# Altium schematic sheet Altium Demo - ADC Schematic.SchDoc: V1I1
size A3; Engineer: Nevi BATAKLI; SheetNumber: 1; SheetTotal: 1
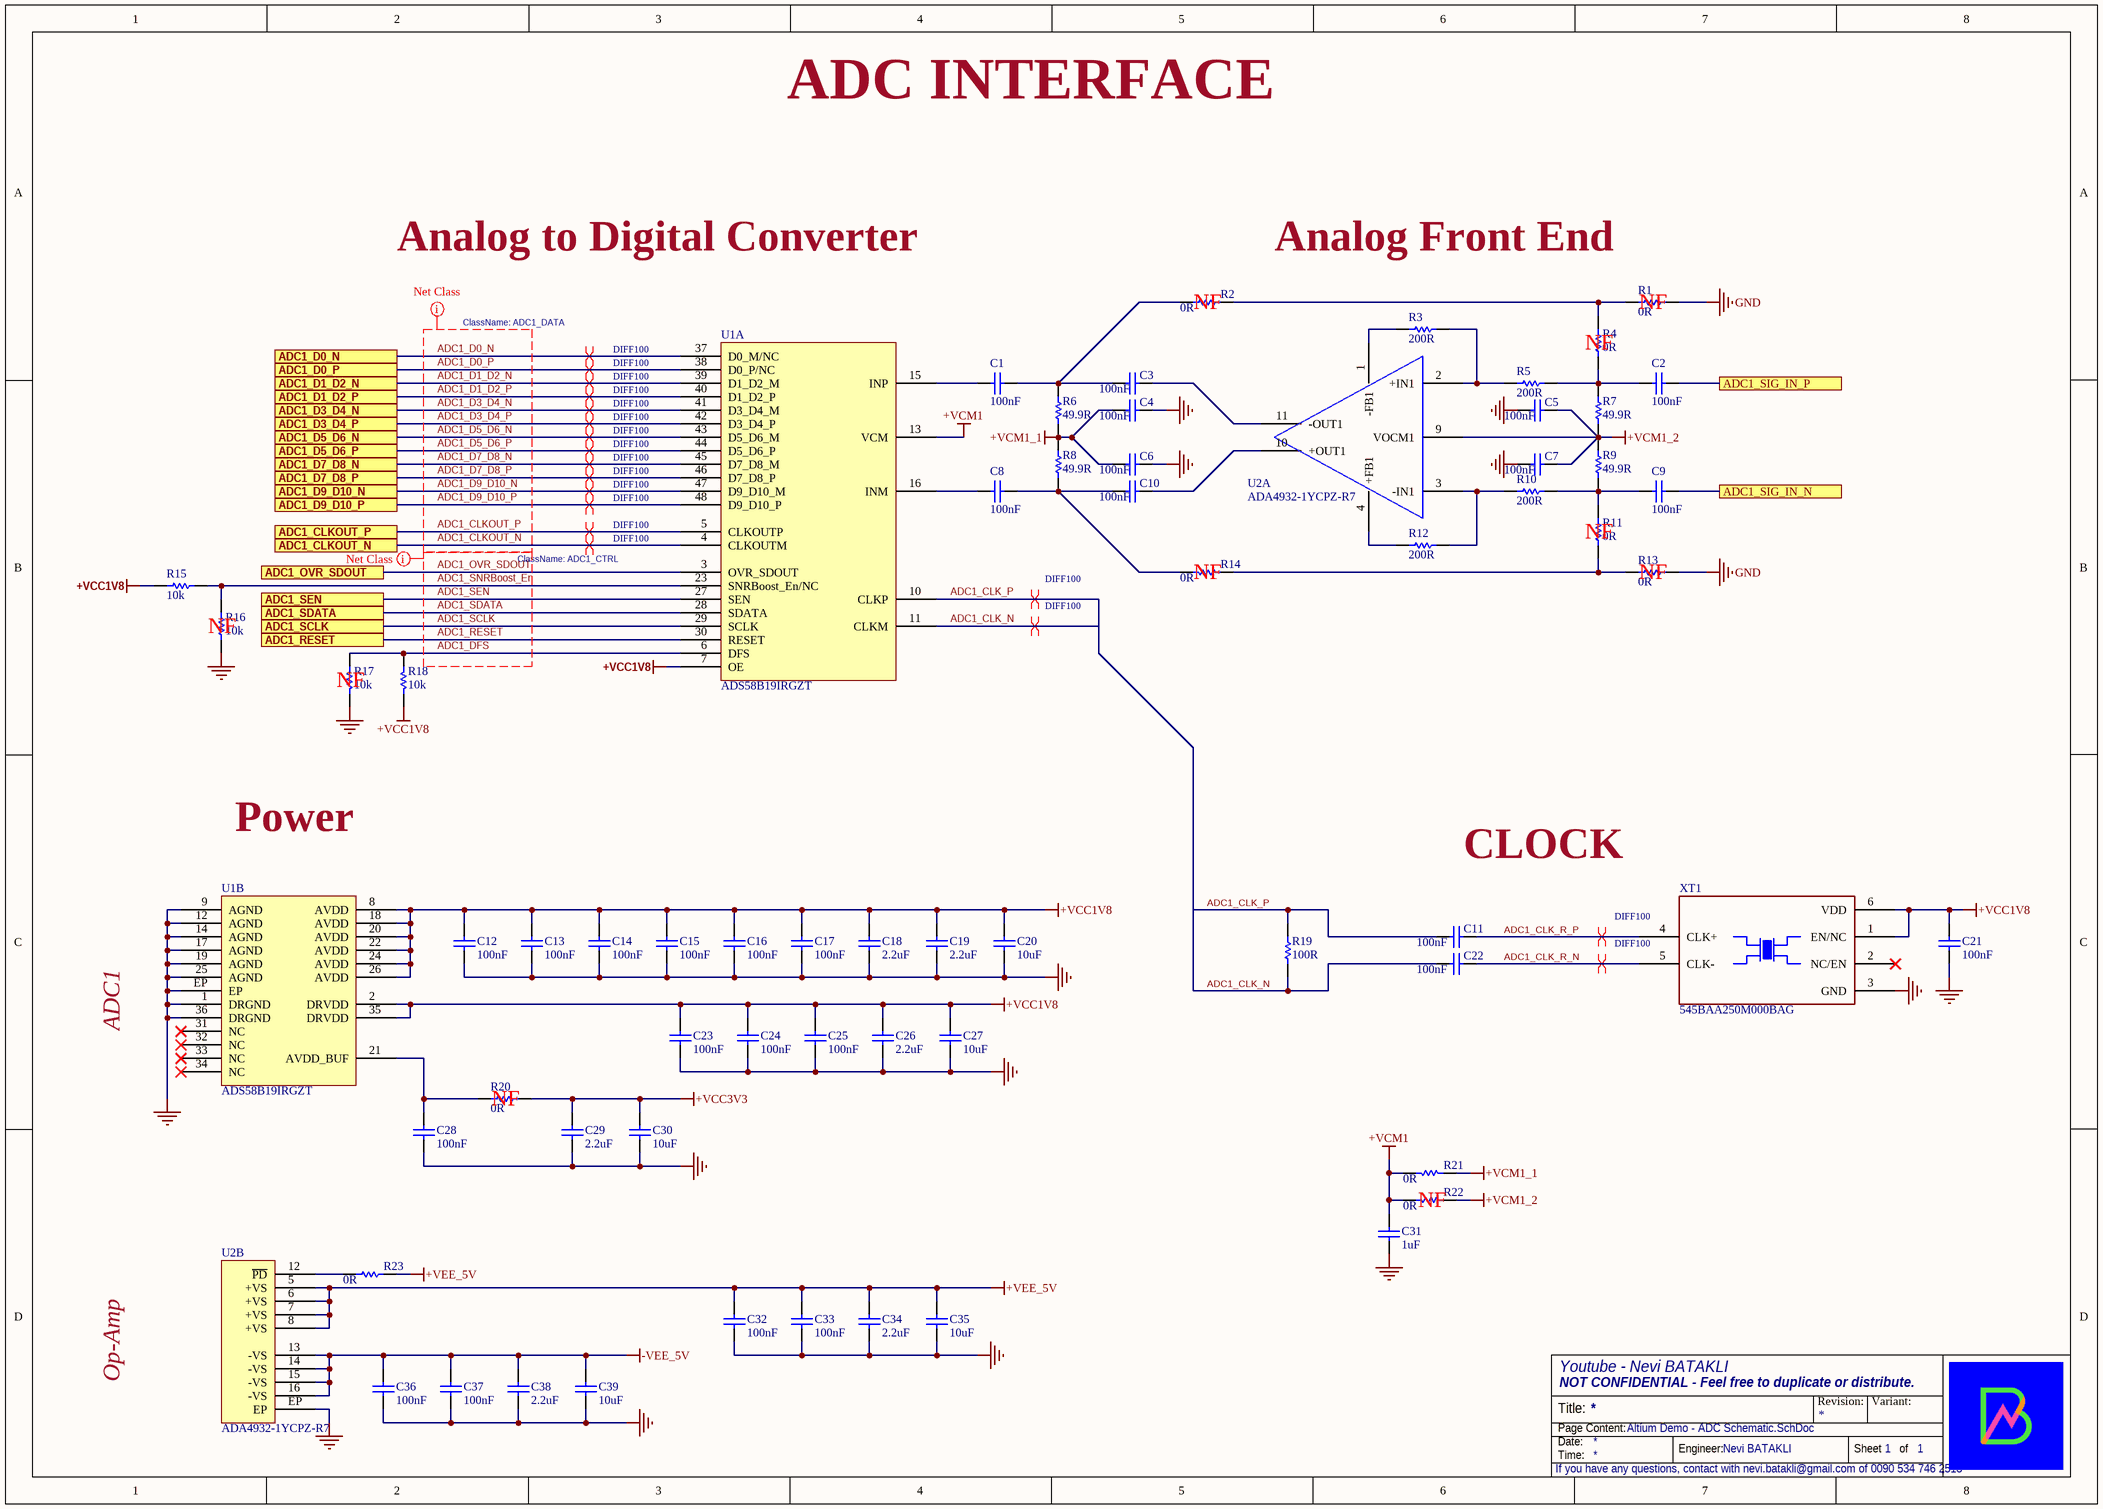
[diagram p0: Altium Demo - ADC Schematic.SchDoc]

## Parts
C1  100nF  [R0201]
C2  100nF  [C0201]
C3  100nF  [C0201]
C4  100nF  [C0402]
C5  100nF  [C0402]
C6  100nF  [C0402]
C7  100nF  [C0402]
C8  100nF  [R0201]
C9  100nF  [C0201]
C10  100nF  [C0201]
C11  100nF  [C0402]
C12  100nF  [C0402]
C13  100nF  [C0402]
C14  100nF  [C0402]
C15  100nF  [C0402]
C16  100nF  [C0402]
C17  100nF  [C0402]
C18  2.2uF  [C0603]
C19  2.2uF  [C0603]
C20  10uF  [C0805]
C21  100nF  [C0402]
C22  100nF  [C0402]
C23  100nF  [C0402]
C24  100nF  [C0402]
C25  100nF  [C0402]
C26  2.2uF  [C0603]
C27  10uF  [C0805]
C28  100nF  [C0402]
C29  2.2uF  [C0603]
C30  10uF  [C0805]
C31  1uF  [C0603]
C32  100nF  [C0402]
C33  100nF  [C0402]
C34  2.2uF  [C0603]
C35  10uF  [C0805]
C36  100nF  [C0402]
C37  100nF  [C0402]
C38  2.2uF  [C0603]
C39  10uF  [C0805]
R1  0R  [R0402]
R2  0R  [R0402]
R3  200R  [R0402]
R4  0R  [R0402]
R5  200R  [R0402]
R6  49.9R  [R0201]
R7  49.9R  [R0402]
R8  49.9R  [R0201]
R9  49.9R  [R0402]
R10  200R  [R0402]
R11  0R  [R0402]
R12  200R  [R0402]
R13  0R  [R0402]
R14  0R  [R0402]
R15  10k  [R0402]
R16  10k  [R0402]
R17  10k  [R0402]
R18  10k  [R0402]
R19  100R  [R0402]
R20  0R  [R0402]
R21  0R  [R0402]
R22  0R  [R0402]
R23  0R  [R0402]
U1  ADS58B19IRGZT  [VFQFN-48 (7x7)]  (parts A,B of 2)
U2  ADA4932-1YCPZ-R7  [VFQFN16 (3x3)]  (parts A,B of 2)
XT1  545BAA250M000BAG  [Si545]

## Ports
ADC1_CLKOUT_N, ADC1_CLKOUT_P, ADC1_D0_N, ADC1_D0_P, ADC1_D1_D2_N, ADC1_D1_D2_P, ADC1_D3_D4_N, ADC1_D3_D4_P, ADC1_D5_D6_N, ADC1_D5_D6_P, ADC1_D7_D8_N, ADC1_D7_D8_P, ADC1_D9_D10_N, ADC1_D9_D10_P, ADC1_OVR_SDOUT, ADC1_RESET, ADC1_SCLK, ADC1_SDATA, ADC1_SEN, ADC1_SIG_IN_N, ADC1_SIG_IN_P

## Nets
+VCC1V8: C12.1 C13.1 C14.1 C15.1 C16.1 C17.1 C18.1 C19.1 C20.1 C21.1 C23.1 C24.1 C25.1 C26.1 C27.1 R15.2 R18.2 U1.2(DRVDD) U1.7(OE) U1.8(AVDD) U1.18(AVDD) U1.20(AVDD) U1.22(AVDD) U1.24(AVDD) U1.26(AVDD) U1.35(DRVDD) XT1.1(EN/NC) XT1.6(VDD)
+VCC3V3: C29.1 C30.1 R20.1
+VCM1: C31.1 R21.2 R22.2 U1.13(VCM)
+VCM1_1: C4.2 C6.2 R6.1 R8.2 R21.1
+VCM1_2: C5.1 C7.1 R7.1 R9.2 R22.1 U2.9(VOCM1)
+VEE_5V: C32.1 C33.1 C34.1 C35.1 R23.1 U2.5(+VS) U2.6(+VS) U2.7(+VS) U2.8(+VS)
-VEE_5V: C36.1 C37.1 C38.1 C39.1 U2.13(-VS) U2.14(-VS) U2.15(-VS) U2.16(-VS)
GND: C4.1 C5.2 C6.1 C7.2 C12.2 C13.2 C14.2 C15.2 C16.2 C17.2 C18.2 C19.2 C20.2 C21.2 C23.2 C24.2 C25.2 C26.2 C27.2 C28.2 C29.2 C30.2 C31.2 C32.2 C33.2 C34.2 C35.2 C36.2 C37.2 C38.2 C39.2 R1.1 R13.2 R16.2 R17.2 U1.1(DRGND) U1.9(AGND) U1.12(AGND) U1.14(AGND) U1.17(AGND) U1.19(AGND) U1.25(AGND) U1.36(DRGND) U1.EP U2.EP XT1.3(GND)
ADC1_CLK_N: C22.2 R19.1 U1.11(CLKM)
ADC1_CLK_P: C11.2 R19.2 U1.10(CLKP)
ADC1_CLK_R_N: C22.1 XT1.5(CLK-)
ADC1_CLK_R_P: C11.1 XT1.4(CLK+)
ADC1_CLKOUT_N: U1.4(CLKOUTM) ; port ADC1_CLKOUT_N
ADC1_CLKOUT_P: U1.5(CLKOUTP) ; port ADC1_CLKOUT_P
ADC1_D0_N: U1.37(D0_M/NC) ; port ADC1_D0_N
ADC1_D0_P: U1.38(D0_P/NC) ; port ADC1_D0_P
ADC1_D1_D2_N: U1.39(D1_D2_M) ; port ADC1_D1_D2_N
ADC1_D1_D2_P: U1.40(D1_D2_P) ; port ADC1_D1_D2_P
ADC1_D3_D4_N: U1.41(D3_D4_M) ; port ADC1_D3_D4_N
ADC1_D3_D4_P: U1.42(D3_D4_P) ; port ADC1_D3_D4_P
ADC1_D5_D6_N: U1.43(D5_D6_M) ; port ADC1_D5_D6_N
ADC1_D5_D6_P: U1.44(D5_D6_P) ; port ADC1_D5_D6_P
ADC1_D7_D8_N: U1.45(D7_D8_M) ; port ADC1_D7_D8_N
ADC1_D7_D8_P: U1.46(D7_D8_P) ; port ADC1_D7_D8_P
ADC1_D9_D10_N: U1.47(D9_D10_M) ; port ADC1_D9_D10_N
ADC1_D9_D10_P: U1.48(D9_D10_P) ; port ADC1_D9_D10_P
ADC1_DFS: R17.1 R18.1 U1.6(DFS)
ADC1_OVR_SDOUT: U1.3(OVR_SDOUT) ; port ADC1_OVR_SDOUT
ADC1_RESET: U1.30(RESET) ; port ADC1_RESET
ADC1_SCLK: U1.29(SCLK) ; port ADC1_SCLK
ADC1_SDATA: U1.28(SDATA) ; port ADC1_SDATA
ADC1_SEN: U1.27(SEN) ; port ADC1_SEN
ADC1_SIG_IN_N: C9.2 ; port ADC1_SIG_IN_N
ADC1_SIG_IN_P: C2.2 ; port ADC1_SIG_IN_P
ADC1_SNRBoost_En: R15.1 R16.1 U1.23(SNRBoost_En/NC)
NetC1_1: C1.1 U1.15(INP)
NetC1_2: C1.2 C3.1 R2.1 R6.2
NetC2_1: C2.1 R4.2 R5.2 R7.2
NetC3_2: C3.2 U2.11(-OUT1)
NetC8_1: C8.1 U1.16(INM)
NetC8_2: C8.2 C10.1 R8.1 R14.1
NetC9_1: C9.1 R9.1 R10.2 R11.1
NetC10_2: C10.2 U2.10(+OUT1)
NetC28_1: C28.1 R20.2 U1.21(AVDD_BUF)
NetR1_2: R1.2 R2.2 R4.1
NetR3_1: R3.1 U2.1(-FB1)
NetR3_2: R3.2 R5.1 U2.2(+IN1)
NetR10_1: R10.1 R12.2 U2.3(-IN1)
NetR11_2: R11.2 R13.1 R14.2
NetR12_1: R12.1 U2.4(+FB1)
NetR23_2: R23.2 U2.12(~{PD})

Not connected (* = marked no-connect by the designer): U1 31(NC)* 32(NC)* 33(NC)* 34(NC)*; XT1 2(NC/EN)*

## Layout directives
net class ADC1_DATA: ADC1_CLKOUT_N, ADC1_CLKOUT_P, ADC1_D0_N, ADC1_D0_P, ADC1_D1_D2_N, ADC1_D1_D2_P, ADC1_D3_D4_N, ADC1_D3_D4_P, ADC1_D5_D6_N, ADC1_D5_D6_P, ADC1_D7_D8_N, ADC1_D7_D8_P, ADC1_D9_D10_N, ADC1_D9_D10_P
differential pair; net class DIFF100: ADC1_CLK_N, ADC1_CLK_P, ADC1_CLK_R_N, ADC1_CLK_R_P, ADC1_CLKOUT_N, ADC1_CLKOUT_P, ADC1_D0_N, ADC1_D0_P, ADC1_D1_D2_N, ADC1_D1_D2_P, ADC1_D3_D4_N, ADC1_D3_D4_P, ADC1_D5_D6_N, ADC1_D5_D6_P, ADC1_D7_D8_N, ADC1_D7_D8_P, ADC1_D9_D10_N, ADC1_D9_D10_P
net class ADC1_CTRL: ADC1_DFS, ADC1_OVR_SDOUT, ADC1_RESET, ADC1_SCLK, ADC1_SDATA, ADC1_SEN, ADC1_SNRBoost_En

## Notes on the sheet
- ADC INTERFACE
- Analog to Digital Converter
- (near R2) NF
- Analog Front End
- (near R1) NF
- (near R4) NF
- (near R14) NF
- (near R11) NF
- (near R13) NF
- (near R16) NF
- (near R17) NF
- Power
- CLOCK
- ADC1
- (near R20) NF
- (near R22) NF
- Op-Amp
- Youtube - Nevi BATAKLI
- NOT CONFIDENTIAL - Feel free to duplicate or distribute.
- Title:
- Page Content:
- Date:
- Time:
- Engineer:
- Revision:
- Sheet
- Variant:
- of
- If you have any questions, contact with nevi.batakli@gmail.com of 0090 534 746 2518

## Library data of the parts
C1-C3 C8-C10 = GRM033C81E104ME14D: CAP CER 0.1UF 25V X6S 0201; Manufacturer 1: Murata; Tolerance: 20%; Supplier 1: Digi-Key; RoHS: Yes; Stock 1: 171376; Pricing 1: 1=0.10000, 10=0.05300, 100=0.02370, 500=0.01690, 1000=0.01328, 2500=0.01208, 5000=0.01111 (USD); Mount: Surface Mount; Case/Package: 0201; Case Code (Metric): 0603; Case Code (Imperial): 0201; Min Operating Temperature: -55°C; Max Operating Temperature: 105°C; Capacitance: 100nF; Packaging: Tape and Reel; Voltage Rating: 25V; Length: 0.024inch; Width: 0.012inch; Thickness: 0.013inch; Supplier Part Number 1: 490-10404-1-ND; Manufacturer Part Number 1: GRM033C81E104ME14D; Weight: 1.2E-05oz; Dielectric: X6S; Termination: SMD/SMT; Voltage Rating (DC): 25V; Package Quantity: 15000; Height: 0.3mm; ComponentLink1URL: http://www.mouser.com/ds/2/281/c02e-2905.pdf?src-supplier=Mouser; ComponentLink1Description: http://www.mouser.com/ds/2/281/c02e-2905.pdf?src-supplier=Mouser; ComponentLink2URL: http://search.murata.co.jp/Ceramy/image/img/A01X/G101/ENG/GRM033C81E104ME14-01.pdf?src-supplier=Digi-Key; ComponentLink2Description: http://search.murata.co.jp/Ceramy/image/img/A01X/G101/ENG/GRM033C81E104ME14-01.pdf?src-supplier=Digi-Key; ComponentLink3URL: http://search.murata.co.jp/Ceramy/image/img/A01X/partnumbering_e_01.pdf?src-supplier=Digi-Key; ComponentLink3Description: http://search.murata.co.jp/Ceramy/image/img/A01X/partnumbering_e_01.pdf?src-supplier=Digi-Key
C4-C7 C11-C17 C21-C25 C28 C32 C33 C36 C37 = CL05B104KO5NNNC: Cap Ceramic 0.1uF 16V X7R 10% SMD 0402 125C Paper T/R; Manufacturer: Samsung; .Creator: NB; Supplier 1: Digi-Key; Manufacturer Part Number: CL05B104KO5NNNC; RoHS: Yes; Stock 1: 74884048; Pricing 1: 1 = 0.10000, 10 = 0.02400, 100 = 0.01070, 500 = 0.00762, 1000 = 0.00598, 2500 = 0.00544, 5000 = 0.00500 (USD); Mount: Surface Mount; Case/Package: 0402; Case Code (Metric): 1005; Case Code (Imperial): 0402; Min Operating Temperature: -55°C; Max Operating Temperature: 125°C; Capacitance: 100nF; Packaging: Tape and Reel; Voltage Rating: 16V; Tolerance: 10%; Length: 1mm; Width: 0.02inch; Thickness: 0.022inch; Lead Free: Lead Free; Supplier Part Number 1: 1276-1001-1-ND; Material: Ceramic; Contact Plating: Tin; Package Quantity: 1; Dielectric: X7R; Voltage: 16V; Voltage Rating (DC): 16V; Height: 0.5mm; Depth: 0.5mm; Radiation Hardening: No; ComponentLink1URL: http://www1.futureelectronics.com/doc/SAMSUNG%20PASSIVE/CL05B104KQ5NNNC.pdf; ComponentLink1Description: http://www1.futureelectronics.com/doc/SAMSUNG%20PASSIVE/CL05B104KQ5NNNC.pdf; ComponentLink2URL: https://www.verical.com/server-webapp/html/getDatasheet?partID=359683; ComponentLink2Description: https://www.verical.com/server-webapp/html/getDatasheet?partID=359683; ComponentLink3URL: https://www.distrelec.biz/Web/Downloads/_e/ng/MLCC_CatalogDownload2013_ENG.pdf?mime=application%2Fpdf; ComponentLink3Description: https://www.distrelec.biz/Web/Downloads/_e/ng/MLCC_CatalogDownload2013_ENG.pdf?mime=application%2Fpdf; ComponentLink4URL: https://produktinfo.conrad.com/datenblaetter/450000-474999/458718-da-01-en-VS_KONDENSATOR_0402.pdf; ComponentLink4Description: https://produktinfo.conrad.com/datenblaetter/450000-474999/458718-da-01-en-VS_KONDENSATOR_0402.pdf
C18 C19 C26 C29 C34 C38 = CL10A225KO8NNNC: Cap Ceramic 2.2uF 16V X5R 10% SMD 0603 85C Paper T/R; Manufacturer: Samsung; .Creator: NB; Supplier 1: Digi-Key; Manufacturer Part Number: CL10A225KO8NNNC; RoHS: Yes; Stock 1: 19734; Pricing 1: 1 = 0.14000, 10 = 0.09600, 100 = 0.04530, 500 = 0.03176, 1000 = 0.02629 (USD); Mount: Surface Mount; Case/Package: 0603; Case Code (Metric): 1608; Case Code (Imperial): 0603; Material: Ceramic; Contact Plating: Tin; Min Operating Temperature: -55°C; Max Operating Temperature: 85°C; Capacitance: 2.2uF; Tolerance: 10%; Packaging: Tape and Reel; Package Quantity: 4000; Voltage Rating: 16V; Dielectric: X5R; Voltage: 16V; Voltage Rating (DC): 16V; Length: 1.6mm; Height: 0.8mm; Width: 0.031inch; Thickness: 0.035inch; Depth: 0.8mm; Radiation Hardening: No; Lead Free: Lead Free; ComponentLink1URL: https://www.verical.com/server-webapp/html/getDatasheet?partID=355165&src-supplier=Verical; ComponentLink1Description: https://www.verical.com/server-webapp/html/getDatasheet?partID=355165&src-supplier=Verical; ComponentLink2URL: http://www.samsungsem.com/kr/support/product-search/mlcc/__icsFiles/afieldfile/2016/08/18/S_CL10A225KO8NNNC.pdf?src-supplier=Digi-Key; ComponentLink2Description: http://www.samsungsem.com/kr/support/product-search/mlcc/__icsFiles/afieldfile/2016/08/18/S_CL10A225KO8NNNC.pdf?src-supplier=Digi-Key; ComponentLink3URL: http://www1.futureelectronics.com/doc/SAMSUNG%20PASSIVE/CL05B104KQ5NNNC.pdf?src-supplier=Future+Electronics; ComponentLink3Description: http://www1.futureelectronics.com/doc/SAMSUNG%20PASSIVE/CL05B104KQ5NNNC.pdf?src-supplier=Future+Electronics; ComponentLink4URL: https://produktinfo.conrad.com/datenblaetter/450000-474999/457919-da-01-en-VS_KONDENSATOR_0603.pdf?src-supplier=Conrad; ComponentLink4Description: https://produktinfo.conrad.com/datenblaetter/450000-474999/457919-da-01-en-VS_KONDENSATOR_0603.pdf?src-supplier=Conrad; Supplier Part Number 1: 1276-1040-1-ND
C20 C27 C30 C35 C39 = CL21A106KOQNNNG: CAP CER 10UF 16V X5R 0805; Manufacturer: Samsung; Material: Ceramic; Tolerance: 10%; .Creator: NB; Supplier 1: Digi-Key; Manufacturer Part Number: CL21A106KOQNNNG; RoHS: Yes; Stock 1: 74251; Pricing 1: 1 = 0.17000, 10 = 0.12300, 100 = 0.05800, 500 = 0.04064, 1000 = 0.03365 (USD); Mount: Surface Mount; Case/Package: 0805; Case Code (Metric): 2012; Case Code (Imperial): 0805; Min Operating Temperature: -55°C; Max Operating Temperature: 85°C; Packaging: Tape and Reel; Package Quantity: 3000; Capacitance: 10uF; Voltage Rating: 16V; Dielectric: X5R; Voltage: 16V; Length: 2mm; Height: 1.25mm; Width: 0.049inch; Thickness: 0.053inch; Depth: 1.25mm; ComponentLink1URL: http://www.samsungsem.com/kr/support/product-search/mlcc/CL21A106KOQNNNG.jsp?src-supplier=Digi-Key; ComponentLink1Description: http://www.samsungsem.com/kr/support/product-search/mlcc/CL21A106KOQNNNG.jsp?src-supplier=Digi-Key; ComponentLink2URL: https://produktinfo.conrad.com/datenblaetter/450000-474999/454932-da-01-en-VS_KONDENSATOR_0805.pdf?src-supplier=Conrad; ComponentLink2Description: https://produktinfo.conrad.com/datenblaetter/450000-474999/454932-da-01-en-VS_KONDENSATOR_0805.pdf?src-supplier=Conrad; Supplier Part Number 1: 1276-6455-1-ND
C31 = CL05B104KO5VPNC: Cap Ceramic 0.1uF 16V X7R 10% SMD 0402 125C Automotive Cardboard T/R; Manufacturer: Samsung; Capacitance: 100nF; .Creator: NB; Supplier 1: Digi-Key; Manufacturer Part Number: CL05B104KO5VPNC; RoHS: Yes; Stock 1: 1650666; Pricing 1: 1 = 0.10000, 10 = 0.03100, 100 = 0.01360, 500 = 0.00974, 1000 = 0.00766, 2500 = 0.00696, 5000 = 0.00640 (USD); Mount: Surface Mount; Case/Package: 0402; Case Code (Metric): 1005; Case Code (Imperial): 0402; Min Operating Temperature: -55°C; Max Operating Temperature: 125°C; Packaging: Cut Tape; Voltage Rating: 16V; Tolerance: 10%; Features: Soft Termination; Length: 0.039inch; Width: 0.02inch; Thickness: 0.022inch; Ratings: AEC-Q200; Lead Free: Lead Free; Supplier 2: Digi-Key; Stock 2: 1650666; Pricing 2: 1 = 0.10000, 10 = 0.03100, 100 = 0.01360, 500 = 0.00974, 1000 = 0.00766, 2500 = 0.00696, 5000 = 0.00640 (USD); Supplier Part Number 1: 1276-6844-1-ND; Supplier Part Number 2: 1276-6844-6-ND
R1 R2 R4 R11 R13 R14 R20-R23 = RC0402JR-070RL: RES SMD 0.0OHM JUMPER 1/16W 0402; Manufacturer: Yageo; .Creator: NB; Resistance: 0mR; Tolerance: 5%; Voltage Rating: 50V; Max Power Dissipation: 63mW; Temperature Coefficient: 200ppm/°C; Power Rating: 62.5mW; Supplier 1: Digi-Key; Manufacturer Part Number: RC0402JR-070RL; Stock 1: 27644767; Pricing 1: 1=0.1, 10=0.014, 25=0.01, 50=0.0078, 100=0.0057, 250=0.00436, 500=0.00348, 1000=0.00257, 5000=0.00184 (USD); Case/Package: 0402; Contact Plating: Matte,Tin; Case Code (Metric): 1005; Case Code (Imperial): 0402; Min Operating Temperature: -55°C; Max Operating Temperature: 155°C; Packaging: Tape and Reel; Composition: Thick Film; Package Quantity: 1; Number of Terminations: 2; Termination: SMD/SMT; Military Standard: Not; Features: Moisture Resistant; Length: 1mm; Height: 0.016inch; Width: 0.02inch; Depth: 0.5mm; Radiation Hardening: No; REACH SVHC: Unknown; Lead Free: Lead Free; ComponentLink1URL: http://www.yageo.com/documents/recent/PYu-RC_Group_51_RoHS_L_9.pdf; ComponentLink1Description: http://www.yageo.com/documents/recent/PYu-RC_Group_51_RoHS_L_9.pdf; ComponentLink2URL: http://www.yageo.com/documents/recent/PYu-RC0402_51_RoHS_L_6.pdf; ComponentLink2Description: http://www.yageo.com/documents/recent/PYu-RC0402_51_RoHS_L_6.pdf; ComponentLink3URL: http://www.farnell.com/datasheets/1018594.pdf; ComponentLink3Description: http://www.farnell.com/datasheets/1018594.pdf; ComponentLink4URL: https://www.verical.com/server-webapp/html/getDatasheet?partID=326379; ComponentLink4Description: https://www.verical.com/server-webapp/html/getDatasheet?partID=326379; ComponentLink5URL: http://www.farnell.com/datasheets/2167052.pdf; ComponentLink5Description: http://www.farnell.com/datasheets/2167052.pdf; Supplier Part Number 1: 311-0.0JRCT-ND
R3 R5 R10 R12 = RC0402FR-07200RL: RES SMD 200 OHM 1% 1/16W 0402; Manufacturer 1: Yageo; Power Rating: 63mW; Voltage Rating: 50V; Temperature Coefficient: 100ppm/°C; Supplier 1: Digi-Key; Manufacturer Part Number 1: RC0402FR-07200RL; Stock 1: 6769600; Pricing 1: 1=0.10000, 10=0.01600, 100=0.00670, 1000=0.00301, 2500=0.00261, 5000=0.00215 (USD); RoHS: Yes; Case/Package: 0402; Case Code (Metric): 1005; Case Code (Imperial): 0402; Min Operating Temperature: -55°C; Max Operating Temperature: 155°C; Resistance: 200R; Tolerance: 1%; Packaging: Tape and Reel; Package Quantity: 1; Composition: Thick Film; Number of Terminations: 2; Termination: SMD/SMT; Military Standard: Not; Max Power Dissipation: 63mW; Voltage Rating (DC): 50V; Features: Moisture Resistant; Length: 1mm; Height: 0.016inch; Width: 0.02inch; Depth: 0.5mm; REACH SVHC: No SVHC; Lead Free: Lead Free; ComponentLink1URL: https://datasheet.ciiva.com/2553/pyu-r-int-thick-7-2553232.pdf?src-supplier=Digi-Key; ComponentLink1Description: https://datasheet.ciiva.com/2553/pyu-r-int-thick-7-2553232.pdf?src-supplier=Digi-Key; ComponentLink2URL: https://datasheet.ciiva.com/7983/1018594-7983509.pdf?src-supplier=Element14; ComponentLink2Description: https://datasheet.ciiva.com/7983/1018594-7983509.pdf?src-supplier=Element14; ComponentLink3URL: https://datasheet.ciiva.com/16804/pyu-rc0402-51-rohs-l-6-r-16804406.pdf?src-supplier=Future+Electronics; ComponentLink3Description: https://datasheet.ciiva.com/16804/pyu-rc0402-51-rohs-l-6-r-16804406.pdf?src-supplier=Future+Electronics; ComponentLink4URL: https://datasheet.ciiva.com/15189/getdatasheetpartid-331152-15189383.pdf?src-supplier=Verical; ComponentLink4Description: https://datasheet.ciiva.com/15189/getdatasheetpartid-331152-15189383.pdf?src-supplier=Verical; ComponentLink5URL: https://datasheet.ciiva.com/7849/1018594-7849898.pdf?src-supplier=Element14; ComponentLink5Description: https://datasheet.ciiva.com/7849/1018594-7849898.pdf?src-supplier=Element14; ComponentLink6URL: https://datasheet.ciiva.com/5562/pyu-rc0402-51-rohs-l-6-r-8721-5562539.pdf?src-supplier=Mouser; ComponentLink6Description: https://datasheet.ciiva.com/5562/pyu-rc0402-51-rohs-l-6-r-8721-5562539.pdf?src-supplier=Mouser; ComponentLink7URL: https://datasheet.ciiva.com/7849/1018594-7849899.pdf?src-supplier=Element14; ComponentLink7Description: https://datasheet.ciiva.com/7849/1018594-7849899.pdf?src-supplier=Element14; ComponentLink8URL: https://datasheet.ciiva.com/2553/pyu-r-int-thick-7-2553230.pdf?src-supplier=Digi-Key; ComponentLink8Description: https://datasheet.ciiva.com/2553/pyu-r-int-thick-7-2553230.pdf?src-supplier=Digi-Key; ComponentLink9URL: https://datasheet.ciiva.com/2553/pyu-r-int-thick-7-2553231.pdf?src-supplier=Digi-Key; ComponentLink9Description: https://datasheet.ciiva.com/2553/pyu-r-int-thick-7-2553231.pdf?src-supplier=Digi-Key; Supplier Part Number 1: 311-200LRCT-ND
R6 R8 = Res_DNP: .Creator: NB; .SCHChecked: NB
R7 R9 = RC0402FR-0749R9L: RES SMD 49.9 OHM 1% 1/16W 0402; Manufacturer 1: Yageo; Voltage Rating (DC): 50V; Power Rating: 62.5mW; Temperature Coefficient: 100ppm/°C; Max Power Dissipation: 63mW; Supplier 1: Digi-Key; Manufacturer Part Number 1: RC0402FR-0749R9L; Stock 1: 20668289; Pricing 1: 1=0.10000, 10=0.01600, 100=0.00670, 1000=0.00301, 2500=0.00261, 5000=0.00215 (USD); RoHS: Yes; Case/Package: 0402; Number of Pins: 2; Case Code (Imperial): 0402; Case Code (Metric): 1005; Min Operating Temperature: -55°C; Max Operating Temperature: 155°C; Packaging: Tape and Reel; Tolerance: 1%; Package Quantity: 1; Features: Moisture Resistant; Resistance: 49.9R; Voltage Rating: 50V; Termination: SMD/SMT; Composition: Thick Film; Number of Terminations: 2; Military Standard: Not; Working Voltage: 50V; Length: 1mm; Height: 0.016inch; Width: 0.5mm; Depth: 0.5mm; Lead Free: Lead Free; REACH SVHC: No SVHC; ComponentLink1URL: https://datasheet.ciiva.com/11819/0900766b80c66297-11819508.pdf?src-supplier=RSComponents; ComponentLink1Description: https://datasheet.ciiva.com/11819/0900766b80c66297-11819508.pdf?src-supplier=RSComponents; ComponentLink2URL: https://datasheet.ciiva.com/7983/1018594-7983542.pdf?src-supplier=Element14; ComponentLink2Description: https://datasheet.ciiva.com/7983/1018594-7983542.pdf?src-supplier=Element14; ComponentLink3URL: https://datasheet.ciiva.com/16743/pyu-rc0402-51-rohs-l-6-r-16743942.pdf?src-supplier=Future+Electronics; ComponentLink3Description: https://datasheet.ciiva.com/16743/pyu-rc0402-51-rohs-l-6-r-16743942.pdf?src-supplier=Future+Electronics; ComponentLink4URL: https://datasheet.ciiva.com/22747/1018594-22747514.pdf?src-supplier=Element14; ComponentLink4Description: https://datasheet.ciiva.com/22747/1018594-22747514.pdf?src-supplier=Element14; ComponentLink5URL: https://datasheet.ciiva.com/2453/pyu-r-int-thick-7-2453355.pdf?src-supplier=Digi-Key; ComponentLink5Description: https://datasheet.ciiva.com/2453/pyu-r-int-thick-7-2453355.pdf?src-supplier=Digi-Key; ComponentLink6URL: https://datasheet.ciiva.com/2453/pyu-r-int-thick-7-2453356.pdf?src-supplier=Digi-Key; ComponentLink6Description: https://datasheet.ciiva.com/2453/pyu-r-int-thick-7-2453356.pdf?src-supplier=Digi-Key; ComponentLink7URL: https://datasheet.ciiva.com/2453/pyu-r-int-thick-7-2453357.pdf?src-supplier=Digi-Key; ComponentLink7Description: https://datasheet.ciiva.com/2453/pyu-r-int-thick-7-2453357.pdf?src-supplier=Digi-Key; Supplier Part Number 1: 311-49.9LRCT-ND
R15-R18 = RC0402FR-0710KL: Yageo RC Series Thick Film Surface Mount Resistor 0402 Case 10000 1% 0.063W 100ppm/C; Manufacturer: Yageo Phycomp; .Creator: NB; Temperature Coefficient: 100ppm/°C; Resistance: 10000R; Power Rating: 63mW; Voltage Rating (DC): 50V; Supplier 1: Digi-Key; Manufacturer Part Number: RC0402FR-0710KL; Stock 1: 102499149; Pricing 1: 1 = 0.10000, 10 = 0.01600, 100 = 0.00670, 1000 = 0.00301, 2500 = 0.00261, 5000 = 0.00215 (USD); RoHS: Yes; Mount: Surface Mount; Case/Package: 0402; Number of Pins: 2; Min Operating Temperature: -55°C; Max Operating Temperature: 155°C; Tolerance: 1%; Packaging: Cut Tape; Length: 1mm; Height: 0.32mm; Width: 500um; Depth: 0.5mm; REACH SVHC: No SVHC; Lead Free: Lead Free; Supplier Part Number 1: 311-10.0KLRCT-ND
R19 = RC0402FR-07100RL: RES SMD 100 OHM 1% 1/16W 0402; Manufacturer 1: Yageo; Voltage Rating: 50V; Temperature Coefficient: 100ppm/°C; Power Rating: 62.5mW; Supplier 1: Digi-Key; Stock 1: 48836352; Pricing 1: 1=0.10000, 10=0.01600, 100=0.00670, 1000=0.00301, 2500=0.00261, 5000=0.00215 (USD); Case/Package: 0402; Case Code (Metric): 1005; Case Code (Imperial): 0402; Min Operating Temperature: -55°C; Max Operating Temperature: 155°C; Resistance: 100R; Packaging: Tape and Reel; Tolerance: 1%; Composition: Thick Film; Termination: SMD/SMT; Military Standard: Not; Length: 1mm; Height: 0.32mm; Width: 0.5mm; Depth: 0.5mm; REACH SVHC: No SVHC; Lead Free: Lead Free; ComponentLink1URL: https://datasheet.ciiva.com/7849/1784430-7849810.pdf?src-supplier=Element14; ComponentLink1Description: https://datasheet.ciiva.com/7849/1784430-7849810.pdf?src-supplier=Element14; ComponentLink2URL: https://datasheet.ciiva.com/11808/0900766b80c66297-11808765.pdf?src-supplier=RSComponents; ComponentLink2Description: https://datasheet.ciiva.com/11808/0900766b80c66297-11808765.pdf?src-supplier=RSComponents; ComponentLink3URL: https://datasheet.ciiva.com/12667/pyu-rc0402-51-rohs-l-6-r-12667957.pdf?src-supplier=Mouser; ComponentLink3Description: https://datasheet.ciiva.com/12667/pyu-rc0402-51-rohs-l-6-r-12667957.pdf?src-supplier=Mouser; ComponentLink4URL: https://datasheet.ciiva.com/16740/pyu-rc0402-51-rohs-l-6-r-16740566.pdf?src-supplier=Future+Electronics; ComponentLink4Description: https://datasheet.ciiva.com/16740/pyu-rc0402-51-rohs-l-6-r-16740566.pdf?src-supplier=Future+Electronics; ComponentLink5URL: https://datasheet.ciiva.com/15189/getdatasheetpartid-329466-15189335.pdf?src-supplier=Verical; ComponentLink5Description: https://datasheet.ciiva.com/15189/getdatasheetpartid-329466-15189335.pdf?src-supplier=Verical; Supplier Part Number 1: 311-100LRCT-ND; Manufacturer Part Number 1: RC0402FR-07100RL; RoHS: Yes; Number of Pins: 2; Voltage Rating (DC): 50V; ComponentLink6URL: https://datasheet.ciiva.com/28367/1018594-28367226.pdf?src-supplier=Element14; ComponentLink6Description: https://datasheet.ciiva.com/28367/1018594-28367226.pdf?src-supplier=Element14; ComponentLink7URL: https://datasheet.ciiva.com/22747/1018594-22747511.pdf?src-supplier=Element14; ComponentLink7Description: https://datasheet.ciiva.com/22747/1018594-22747511.pdf?src-supplier=Element14
U1 = ADS58B19IRGZT: IC ADC 9BIT 250MSPS 48VQFN; Manufacturer: Texas Instruments; Number of Channels: 1; Max Power Dissipation: 10mW; Interface: LVDS; Number of Bits: 9; Sampling Rate: 250000000S/s; Resolution: 14b; Supply Type: Analog; Conversion Rate: 200MS/s; Signal to Noise Ratio (SNR): 66dB; Power Consumption: 287mW; Min Supply Voltage: 1.7V; Max Supply Voltage: 1.9V; Integral Nonlinearity (INL): 1.2LSB; Supplier 1: Digi-Key; Manufacturer Part Number: ADS58B19IRGZT; Stock 1: 740; Pricing 1: 1 = 29.04000, 10 = 26.78200, 100 = 22.87030 (USD); RoHS: Yes; Mount: Surface Mount; Case/Package: VQFN; Number of Pins: 48; Contact Plating: Gold; Min Operating Temperature: -40°C; Max Operating Temperature: 85°C; Packaging: Tape and Reel; Package Quantity: 250; Number of Converters: 1; Number of Analog Inputs: 1; Power Dissipation: 287mW; Number of A/D Converters: 1; Number of Inputs: 1; Lead Free: Lead Free; ComponentLink1URL: https://datasheet.ciiva.com/14259/sbas487d-14259706.pdf?src-supplier=Avnet; ComponentLink1Description: https://datasheet.ciiva.com/14259/sbas487d-14259706.pdf?src-supplier=Avnet; ComponentLink2URL: https://datasheet.ciiva.com/1310/ads58b18-1310156.pdf?src-supplier=Digi-Key; ComponentLink2Description: https://datasheet.ciiva.com/1310/ads58b18-1310156.pdf?src-supplier=Digi-Key; ComponentLink3URL: https://datasheet.ciiva.com/1310/ads58b18-1310157.pdf?src-supplier=Digi-Key; ComponentLink3Description: https://datasheet.ciiva.com/1310/ads58b18-1310157.pdf?src-supplier=Digi-Key; ComponentLink4URL: https://datasheet.ciiva.com/1310/ads58b18-1310158.pdf?src-supplier=Digi-Key; ComponentLink4Description: https://datasheet.ciiva.com/1310/ads58b18-1310158.pdf?src-supplier=Digi-Key; Supplier Part Number 1: 296-28296-1-ND
U2 = ADA4932-1YCPZ-R7: IC OPAMP DIFF 560MHZ 16LFCSP; Manufacturer: Analog Devices; Number of Channels: 1; Common Mode Rejection Ratio: 87dB; Max Supply Voltage: 11V; Min Supply Voltage: 3V; Min Dual Supply Voltage: 1.5V; Max Dual Supply Voltage: 5.5V; Slew Rate: 410V/µs; Input Bias Current: 2.5uA; Input Offset Voltage (Vos): 500uV; Operating Supply Current: 9.6mA; Output Current per Channel: 80mA; Settling Time: 9ns; Voltage Gain: 66dB; Power Supply Rejection Ratio (PSRR): 84dB; Gain Bandwidth Product: 1GHz; Input Resistance: 16MR; .Creator: NB; Supplier 1: Digi-Key; Manufacturer Part Number: ADA4932-1YCPZ-R7; Stock 1: 10627; Pricing 1: 1=7.23, 10=6.533, 100=5.4085, 500=4.70968 (USD); Case/Package: LFCSP EP; Number of Pins: 16; Contact Plating: Matte,Tin; Min Operating Temperature: -40°C; Max Operating Temperature: 105°C; Package Quantity: 1500; -3db Bandwidth: 560MHz; Bandwidth: 560MHz; Packaging: Tape and Reel; Number of Circuits: 1; Number of Elements: 1; Number of Amplifiers: 1; REACH SVHC: No SVHC; Lead Free: Contains Lead; ComponentLink1URL: http://www.analog.com/media/en/technical-documentation/data-sheets/ADA4932-1_4932-2.pdf; ComponentLink1Description: http://www.analog.com/media/en/technical-documentation/data-sheets/ADA4932-1_4932-2.pdf; ComponentLink2URL: https://www.analog.com/media/en/technical-documentation/data-sheets/ADA4932-1_4932-2.pdf; ComponentLink2Description: https://www.analog.com/media/en/technical-documentation/data-sheets/ADA4932-1_4932-2.pdf; ComponentLink3URL: http://www.analog.com/static/imported-files/data_sheets/ADA4932-1_4932-2.pdf; ComponentLink3Description: http://www.analog.com/static/imported-files/data_sheets/ADA4932-1_4932-2.pdf; ComponentLink4URL: http://www.produktinfo.conrad.com/datenblaetter/1200000-1299999/001249703-da-01-en-IC_AMP_DIF_ADA4932_1YCPZ_R7_LFCSP_16_ADI.pdf; ComponentLink4Description: http://www.produktinfo.conrad.com/datenblaetter/1200000-1299999/001249703-da-01-en-IC_AMP_DIF_ADA4932_1YCPZ_R7_LFCSP_16_ADI.pdf; Supplier Part Number 1: ADA4932-1YCPZ-R7CT-ND
XT1 = 545BAA250M000BAG: XTAL OSC XO 250.0000MHZ LVDS SMD; Manufacturer: Silicon Labs; .Creator: NB; Supplier 1: Digi-Key; Manufacturer Part Number: 545BAA250M000BAG; Stock 1: 196; Pricing 1: 1 = 11.26000, 25 = 10.84720, 100 = 10.42990 (USD); Supplier Part Number 1: 336-4026-ND